# Altium schematic sheet Batterij.SchDoc
size A; SheetNumber: 5; SheetTotal: 5
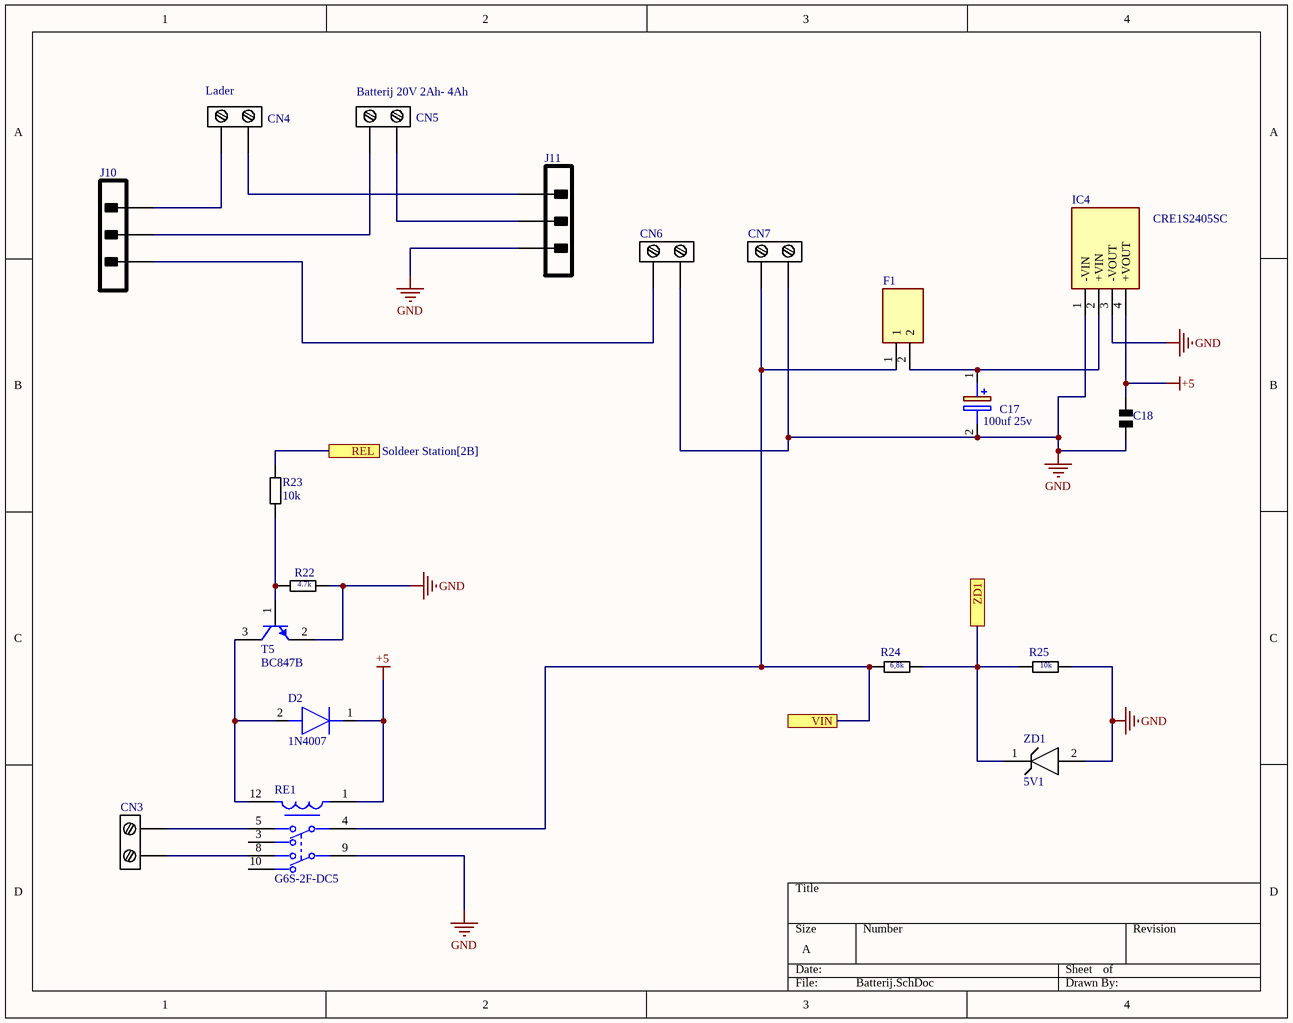
[diagram p0: Batterij.SchDoc]

## Parts
C17  100uf 25v  [100uf 25v]
C18  C0402C104K4RACTU  [Capacitor]  (value not drawn)
CN3  K1,K2,K3,K8 Printkroonsteen  [K1,K2,K3,K8 Printkroonsteen]  (value not drawn)
CN4  Lader  [K1,K2,K3,K8 Printkroonsteen]
CN5  Batterij 20V 2Ah- 4Ah  [K1,K2,K3,K8 Printkroonsteen]
CN6  K1,K2,K3,K8 Printkroonsteen  [K1,K2,K3,K8 Printkroonsteen]  (value not drawn)
CN7  K1,K2,K3,K8 Printkroonsteen  [K1,K2,K3,K8 Printkroonsteen]  (value not drawn)
D2  1N4007  [1N4007]
F1  (no value)  [65800201009]
IC4  CRE1S2405SC  [CRE1(SC)]
J10  K4,7,10 3Pinheader  [K4,7,10 3Pinheader]  (value not drawn)
J11  K4,7,10 3Pinheader  [K4,7,10 3Pinheader]  (value not drawn)
R22  4.7k  [Resistor]
R23  10k  [Resistor]
R24  6,8k  [Resistor]
R25  10k  [Resistor]
RE1  G6S-2F-DC5  [G6S-2F-DC5]
T5  BC847B  [BC847B]
ZD1  5V1  [1N4007]

## Ports
REL (see Soldeer Station[2B]), VIN (see Verwarmingselement[2B]), ZD1 (see Soldeer Station[4B])

## Nets
+5: C18.2 D2.1(K) IC4.4(+VOUT) RE1.1
GND: C17.2(-) C18.1 CN6.2 CN7.2 IC4.1(-VIN) IC4.3(-VOUT) J11.1 R22.2 R25.2 RE1.9 T5.2(C) ZD1.2(A)
REL: R23.2 ; port REL
VIN: CN7.1 F1.1 R24.1 RE1.4 ; port VIN
ZD1: R24.2 R25.1 ZD1.1(C) ; port ZD1
NetC17_1: C17.1(+) F1.2 IC4.2(+VIN)
NetCN3_1: CN3.1 RE1.8
NetCN3_2: CN3.2 RE1.5
NetCN4_1: CN4.1 J10.1
NetCN4_2: CN4.2 J11.3
NetCN5_1: CN5.1 J10.2
NetCN5_2: CN5.2 J11.2
NetCN6_1: CN6.1 J10.3
NetD2_2: D2.2(A) RE1.12 T5.3(E)
NetR22_1: R22.1 R23.1 T5.1(B)

Not connected (* = marked no-connect by the designer): RE1 3 10

## Library data of the parts
C17 = 100uf 25v: Capacitor Polarised; Manufacturer_Name: Chemi-Con; Manufacturer_Part_Number: ESMG250ELL101MF11D; Datasheet Link: http://www.chemi-con.co.jp/cgi-bin/CAT_DB/SEARCH/cat_db_al.cgi?e=e&j=p&pdfname=smg; Height: 12.5mm; Mouser Part Number: 661-ESMG250ELL101MF; Mouser Price/Stock: https://www.mouser.co.uk/ProductDetail/Chemi-Con/ESMG250ELL101MF11D?qs=46VwSHQt9xX2tXRf6ZkiIw%3D%3D; Arrow Part Number: ESMG250ELL101MF11D; Arrow Price/Stock: https://www.arrow.com/en/products/esmg250ell101mf11d/united-chemi-con?region=nac
C18 = Condensator: Manufacturer: Kemet; Part Number: C0402C104K4RACTU
CN3-CN7 = K1,K2,K3,K8 Printkroonsteen: MF: TE Connectivity; MP: 282837-2; SnapEDA_Link: https://www.snapeda.com/parts/282837-2/TE+Connectivity+AMP+Connectors/view-part/?ref=snap; Price: None; Check_prices: https://www.snapeda.com/parts/282837-2/TE+Connectivity+AMP+Connectors/view-part/?ref=eda; Purchase-URL: https://pricing.snapeda.com/search/part/282837-2/?ref=eda; Value: *; Availability: In Stock; Package: None
D2 = 1N4007: Diode; Manufacturer_Name: Vishay; Manufacturer_Part_Number: 1N4007-E3/73; Datasheet Link: https://mouser.componentsearchengine.com/Datasheets/2/1N4007-E3_73.pdf; Mouser Part Number: 625-1N4007-E3/73; Mouser Price/Stock: https://www.mouser.co.uk/ProductDetail/Vishay-General-Semiconductor/1N4007-E3-73?qs=N4vtoAxH%2FSqT3Ng3e4K0Gw%3D%3D; Arrow Part Number: 1N4007-E3/73; Arrow Price/Stock: https://www.arrow.com/en/products/1n4007-e373/vishay?region=europe
F1 = 65800201009: Hardware; Manufacturer_Name: LITTELFUSE; Datasheet Link: https://www.littelfuse.com/media?resourcetype=datasheets&itemid=8563b5b9-30c3-4ebb-8e89-3cabf2bd05b5&filename=littelfuse-fuse-block-658-datasheet; Height: 13.2mm; Manufacturer_Part_Number: 65800201009
IC4 = CRE1S2405SC: Undefined or Miscellaneous; Manufacturer_Name: Murata Electronics; Datasheet Link: http://power.murata.com/datasheet?/data/power/ncl/kdc_cre1.pdf; Manufacturer_Part_Number: CRE1S2405SC; Mouser Part Number: 580-CRE1S2405SC; Mouser Price/Stock: https://www.mouser.co.uk/ProductDetail/Murata-Power-Solutions/CRE1S2405SC?qs=pFP7BvE1PmwUsyXD%252BXcXxQ%3D%3D; Arrow Part Number: CRE1S2405SC; Arrow Price/Stock: https://www.arrow.com/en/products/cre1s2405sc/murata-power-solutions
J10 J11 = K4,7,10 3Pinheader: NexarPartId: 278173; Voltage Rating: 250V; Number of Contacts: 5; Contact Resistance: 20mΩ; Gender: Male; Pitch: 2.54mm; Connector Type: Male Pin; Current Rating: 4A; Glow Wire Compliant: Non-compliant; Max Voltage Rating (DC): 250.25kV; Flammability Rating: UL94 V-0; Min Operating Temperature: 0°C; REACH SVHC: Unknown; Lead Free: Lead Free; Termination: Solder; RoHS: Compliant; Schedule B: 8536694040|8536694040|8536694040|8536694040|8536694040|8536694040|8536694040|8536694040|8536694040|8536694040|8536694040|8536694040|8536694040|8536694040|8536694040|8536694040|8536694040|8536694040|8536694040|8536694040|8536694040|8536694040|8536694040|85; Number of Circuits: 5; Mount: Through Hole; Lead Pitch: 2.54mm; Height: 2.29mm; Voltage Rating (DC): 250V; Max Operating Temperature: 75°C; Width: 2.49mm; Radiation Hardening: No; Contact Plating: Tin; Orientation: Vertical; Length: 12.7mm; Number of Rows: 1; Housing Material: Thermoplastic; Contact Material: Brass; Packaging: Bulk; Contact Mating Length: 6.096mm; Housing Color: Black; Color: Black; Number of Positions: 5
R22-R25 = Resistor: Manufacturer: Vishay Dale; Part Number: CRCW08050000Z0EA
RE1 = G6S-2F-DC5: Manufacturer: Omron; Coil Resistance: 178Ω; Switching Current: 2A; Coil Current: 28.1mA; Throw Configuration: DPDT; Coil Voltage: 5V; Standoff Height: 0.35mm; Coil Power: 140mW; Coil Type: Non-Latching; Number Of Contacts: 2; RoHS: TRUE; Device Class L3: Signal Relays; Ambient Temperature Range Low: -40°C; Device Class L1: Electromechanical; Lead Free: Yes; Category: Relay; Digikey Description: RELAY TELECOM DPDT 2A 5VDC; Height: 9.4mm; Temperature: -40°C to +85°C; Octopart: https://octopart.com/g6s-2f-dc5-omron-85236; Package: G6S-2F-DC5; Temperature Range High: +85°C; Automotive: No; Current Rating: 2A; Manufacturer Part Number: G6S-2F-DC5; Mouser Description: Electromechanical Relay 5VDC 178Ohm 2A DPDT (14.8x9.2x9.2)mm SMD Signal Relay; Temperature Range Low: -40°C; Device Class L2: Relays; Ambient Temperature Range High: +85°C; ComponentLink2URL: https://omronfs.omron.com/en_US/ecb/products/pdf/en-g6s.pdf; ComponentLink2Description: Datasheet
T5 = BC847B: NPN Silicon AF Transistor; Manufacturer: Infineon; VEBO (max): 6Â V; ICBO (max): 15Â nA; VCBO (max): 50Â V; IBM (max): 200Â mA; Packing: Reel; Green: TRUE; Ptot (max): 330Â mW; fT (typ): 250Â MHz; IC (max): 100Â mA; VCEO (max): 45Â V; PackageDescription: 3-Pin Small Outline Transistor Package, 1.3 x 2.9 mm Body, 0.95 mm Pitch; ComponentLink3URL: http://www.infineon.com/dgdl/SOT23-Package_Overview.pdf?folderId=db3a30431936bc4b0119532290053c66&fileId=db3a30431936bc4b0119533468123c85; PackageVersion: Apr-08; ComponentLink3Description: Package Specification; ComponentLink2URL: http://www.infineon.com/dgdl/bc847series_bc848series_bc849series_bc850series.pdf?folderId=db3a304314dca389011541d30fa21656&fileId=db3a304314dca389011541d4630a1657; ComponentLink1URL: http://www.infineon.com/; ComponentLink2Description: Datasheet; Polarity: NPN; Mounting Technology: Surface Mount; PackageReference: SOT23; ICM (max): 200Â mA; ComponentLink1Description: Manufacturer URL; PartNumber: BC847B
ZD1 = Zenerdiode: BZM55B5V1-TR; Zener Voltage: 5.1V; Element Configuration: Single; Impedance: 60R; ESD Protection: No; Voltage Tolerance: 2%; Power Dissipation: 500mW; Max Reverse Leakage Current: 100nA; Test Current: 5mA; Max Operating Temperature: 175°C; Series: -; Package Quantity: 12500; Min Operating Temperature: -65°C; Radiation Hardening: No; RoHS Compliant: Yes; Contact Plating: Tin; Max Power Dissipation: 500mW; Number of Pins: 2; Packaging: Tape and Reel; Mount: Surface Mount; Case/Package: SMD/SMT